# EAGLE schematic Proto_Blob_A (EAGLE 9.0.1)
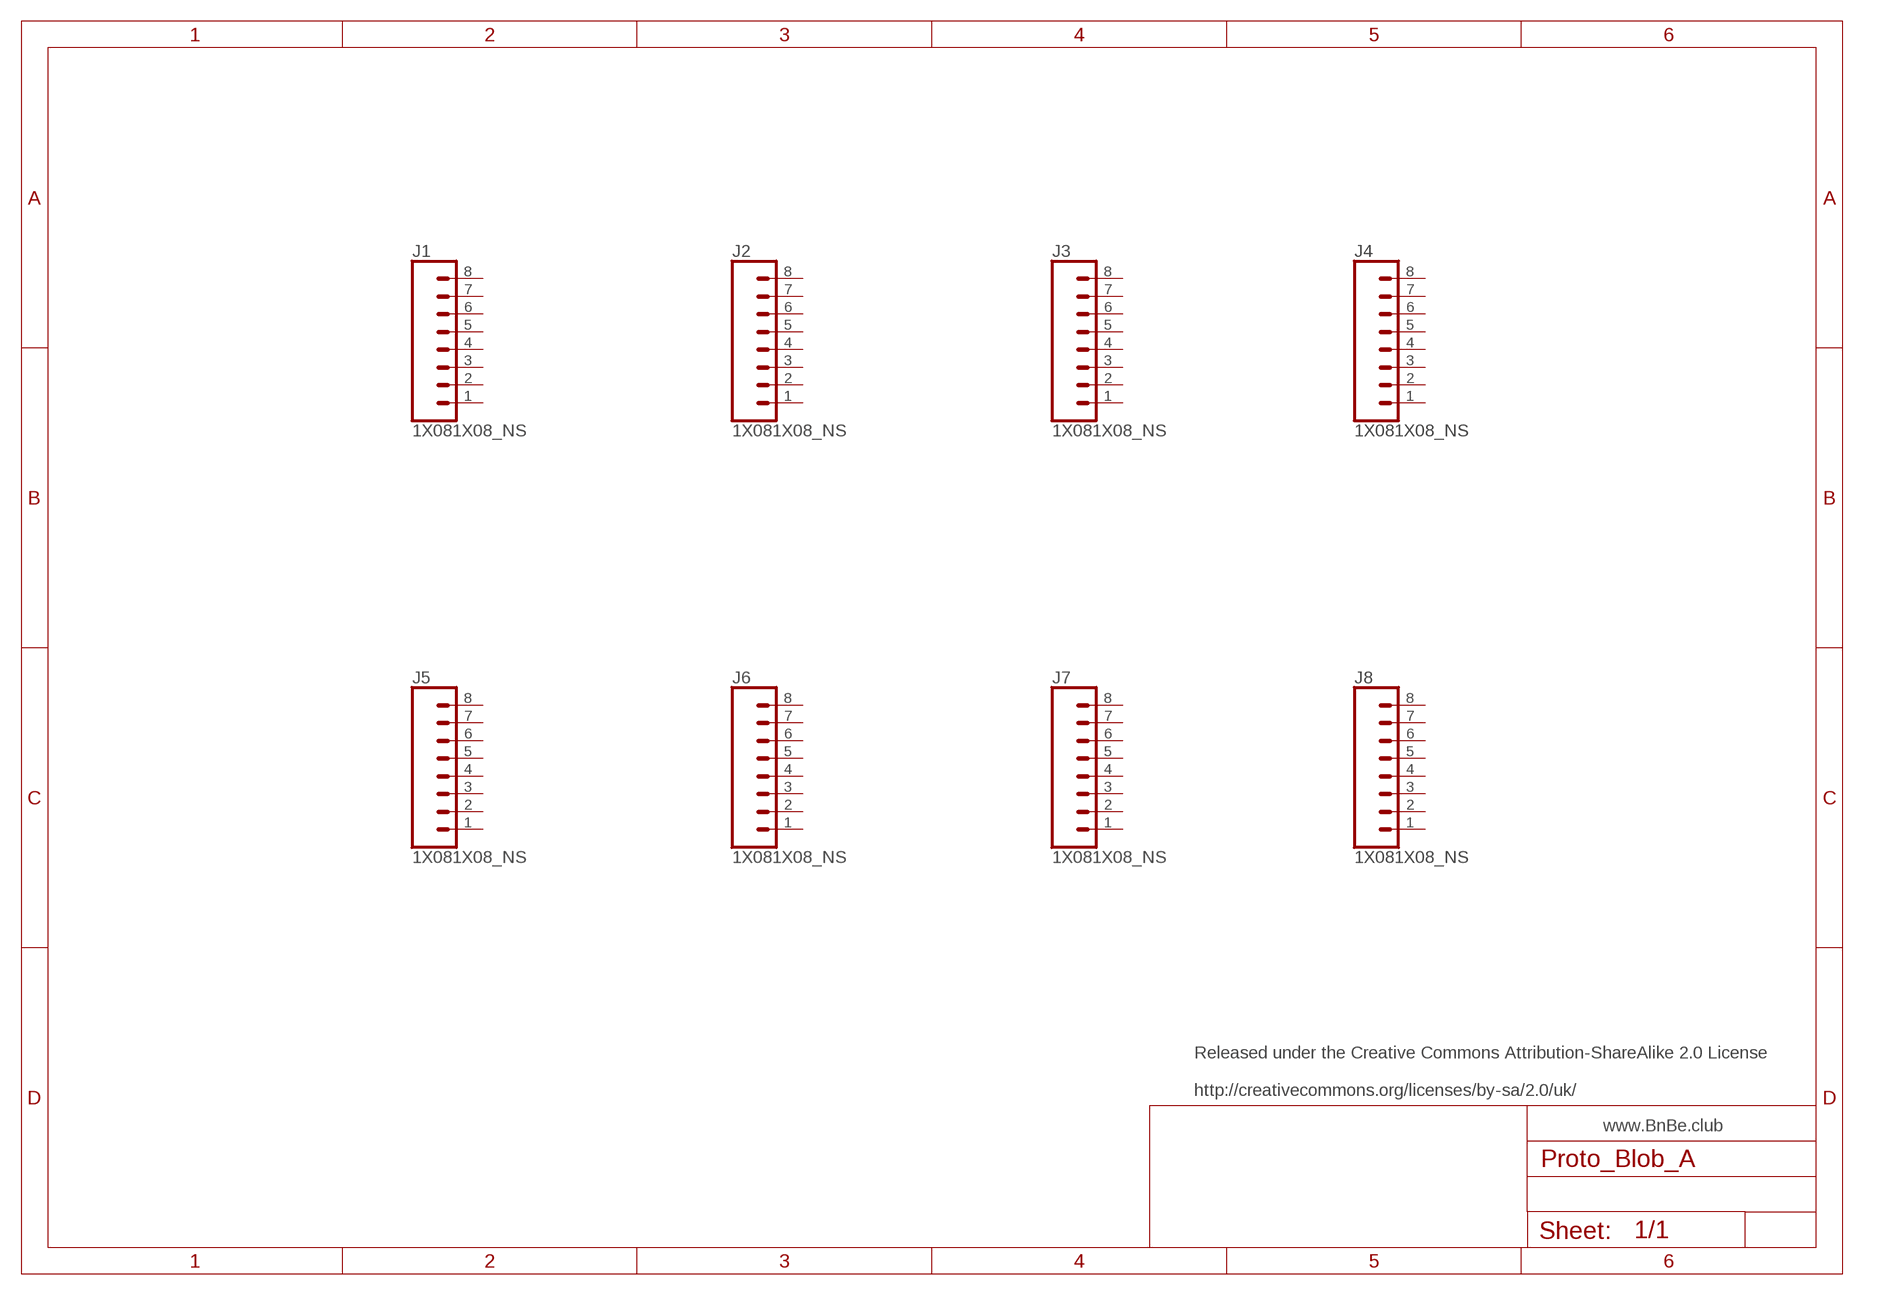
[diagram p0: schematic, sheet 1]

## Parts
J1  1X081X08_NS  [1X08_NS]
J2  1X081X08_NS  [1X08_NS]
J3  1X081X08_NS  [1X08_NS]
J4  1X081X08_NS  [1X08_NS]
J5  1X081X08_NS  [1X08_NS]
J6  1X081X08_NS  [1X08_NS]
J7  1X081X08_NS  [1X08_NS]
J8  1X081X08_NS  [1X08_NS]
Unconnected: J1.1 J1.2 J1.3 J1.4 J1.5 J1.6 J1.7 J1.8 J2.1 J2.2 J2.3 J2.4 J2.5 J2.6 J2.7 J2.8 J3.1 J3.2 J3.3 J3.4 J3.5 J3.6 J3.7 J3.8 J4.1 J4.2 J4.3 J4.4 J4.5 J4.6 J4.7 J4.8 J5.1 J5.2 J5.3 J5.4 J5.5 J5.6 J5.7 J5.8 J6.1 J6.2 J6.3 J6.4 J6.5 J6.6 J6.7 J6.8 J7.1 J7.2 J7.3 J7.4 J7.5 J7.6 J7.7 J7.8 J8.1 J8.2 J8.3 J8.4 J8.5 J8.6 J8.7 J8.8

## Notes on the sheet
- Released under the Creative Commons Attribution-ShareAlike 2.0 License
  
  http://creativecommons.org/licenses/by-sa/2.0/uk/
- www.BnBe.club

## Library data of the parts
J1-J8 = Frenoy_Custom:1X08